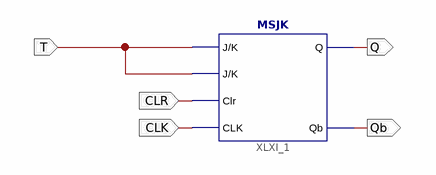
[diagram p0: schematic sheet 1]
// Xilinx ISE schematic TFF.sch (spartan3a) as structural Verilog: 1 symbols, 5 ports
module TFF (
  input  T,
  input  CLR,
  input  CLK,
  output Q,
  output Qb
);

  MSJK XLXI_1 (.J(T), .K(T), .Clr(CLR), .CLK(CLK), .Q(Q), .Qb(Qb));
endmodule
